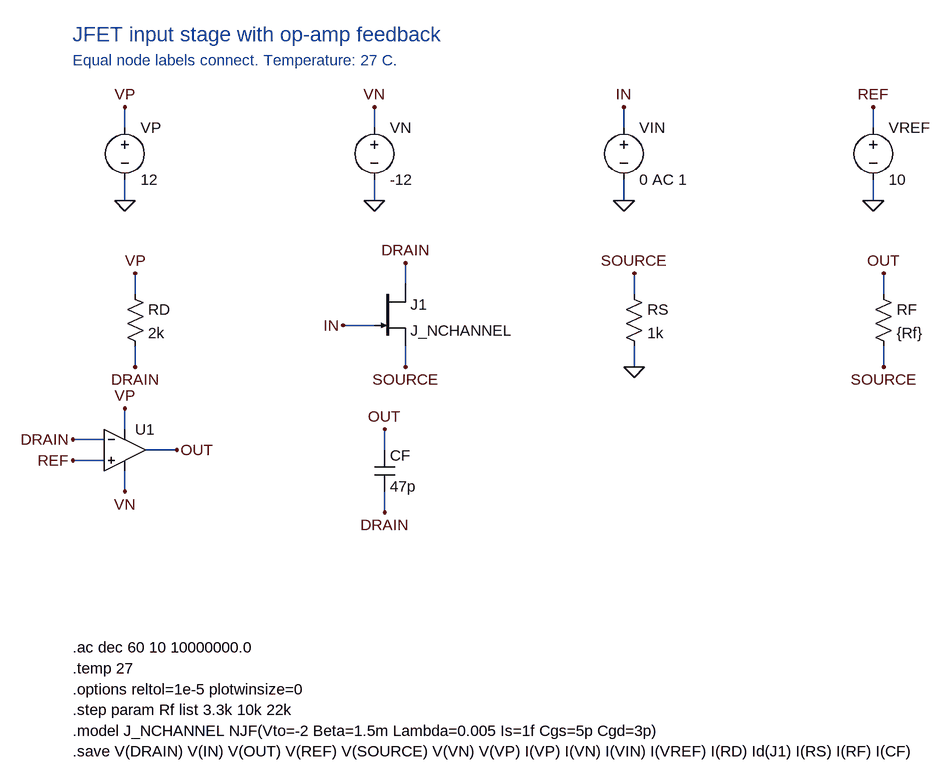
[diagram p0: schematic jfet-opamp-feedback.asc]
jfet-opamp-feedback.asc, the LTspice schematic file:
Version 4
SHEET 1 1740 1288
WIRE 144 176 144 144
WIRE 144 256 144 288
WIRE 528 176 528 144
WIRE 528 256 528 288
WIRE 912 176 912 144
WIRE 912 256 912 288
WIRE 1296 176 1296 144
WIRE 1296 256 1296 288
WIRE 160 432 160 400
WIRE 160 512 160 544
WIRE 576 416 576 384
WIRE 528 480 480 480
WIRE 576 512 576 544
WIRE 928 432 928 400
WIRE 928 512 928 544
WIRE 1312 432 1312 400
WIRE 1312 512 1312 544
WIRE 112 688 64 688
WIRE 112 656 64 656
WIRE 144 640 144 608
WIRE 144 704 144 736
WIRE 176 672 224 672
WIRE 544 672 544 640
WIRE 544 736 544 768
FLAG 144 144 VP
FLAG 144 288 0
FLAG 528 144 VN
FLAG 528 288 0
FLAG 912 144 IN
FLAG 912 288 0
FLAG 1296 144 REF
FLAG 1296 288 0
FLAG 160 400 VP
FLAG 160 544 DRAIN
FLAG 576 384 DRAIN
FLAG 480 480 IN
FLAG 576 544 SOURCE
FLAG 928 400 SOURCE
FLAG 928 544 0
FLAG 1312 400 OUT
FLAG 1312 544 SOURCE
FLAG 64 688 REF
FLAG 64 656 DRAIN
FLAG 144 608 VP
FLAG 144 736 VN
FLAG 224 672 OUT
FLAG 544 640 OUT
FLAG 544 768 DRAIN
SYMBOL voltage 144 160 R0
SYMATTR InstName VP
SYMATTR Value 12
SYMBOL voltage 528 160 R0
SYMATTR InstName VN
SYMATTR Value -12
SYMBOL voltage 912 160 R0
SYMATTR InstName VIN
SYMATTR Value 0 AC 1
SYMBOL voltage 1296 160 R0
SYMATTR InstName VREF
SYMATTR Value 10
SYMBOL res 144 416 R0
SYMATTR InstName RD
SYMATTR Value 2k
SYMBOL njf 528 416 R0
SYMATTR InstName J1
SYMATTR Value J_NCHANNEL
SYMBOL res 912 416 R0
SYMATTR InstName RS
SYMATTR Value 1k
SYMBOL res 1296 416 R0
SYMATTR InstName RF
SYMATTR Value {Rf}
SYMBOL OpAmps/UniversalOpamp2 144 672 R0
SYMATTR InstName U1
SYMATTR SpiceModel level2
SYMATTR Value2 Avol=1Meg GBW=10Meg Slew=10Meg
SYMATTR SpiceLine Ilimit=100m Rail=0.5 Vos=0
SYMATTR SpiceLine2 En=0 Enk=0 In=0 Ink=0 Rin=1G
SYMBOL cap 528 672 R0
SYMATTR InstName CF
SYMATTR Value 47p
TEXT 64 32 Left 3 ;JFET input stage with op-amp feedback
TEXT 64 72 Left 2 ;Equal node labels connect. Temperature: 27 C.
TEXT 64 976 Left 2 !.ac dec 60 10 10000000.0
TEXT 64 1008 Left 2 !.temp 27
TEXT 64 1040 Left 2 !.options reltol=1e-5 plotwinsize=0
TEXT 64 1072 Left 2 !.step param Rf list 3.3k 10k 22k
TEXT 64 1104 Left 2 !.model J_NCHANNEL NJF(Vto=-2 Beta=1.5m Lambda=0.005 Is=1f Cgs=5p Cgd=3p)
TEXT 64 1136 Left 2 !.save V(DRAIN) V(IN) V(OUT) V(REF) V(SOURCE) V(VN) V(VP) I(VP) I(VN) I(VIN) I(VREF) I(RD) Id(J1) I(RS) I(RF) I(CF)

The netlist it stands for:
* jfet-opamp-feedback.asc
VP VP 0 12
VN VN 0 -12
VIN IN 0 0 AC 1
VREF REF 0 10
RD VP DRAIN 2k
J1 DRAIN IN SOURCE J_NCHANNEL
RS SOURCE 0 1k
RF OUT SOURCE {Rf}
XU1 REF DRAIN VP VN OUT level2 Avol=1Meg GBW=10Meg Slew=10Meg Ilimit=100m Rail=0.5 Vos=0 En=0 Enk=0 In=0 Ink=0 Rin=1G  ; pins In+ In- V+ V- OUT
CF OUT DRAIN 47p
.model NJF NJF
.model PJF PJF
.lib standard.jft
* JFET input stage with op-amp feedback
* Equal node labels connect. Temperature: 27 C.
.ac dec 60 10 10000000.0
.temp 27
.options reltol=1e-5 plotwinsize=0
.step param Rf list 3.3k 10k 22k
.model J_NCHANNEL NJF(Vto=-2 Beta=1.5m Lambda=0.005 Is=1f Cgs=5p Cgd=3p)
.save V(DRAIN) V(IN) V(OUT) V(REF) V(SOURCE) V(VN) V(VP) I(VP) I(VN) I(VIN) I(VREF) I(RD) Id(J1) I(RS) I(RF) I(CF)
.lib UniversalOpAmp2.lib
.backanno
.end